# Altium schematic sheet AnalogMux.SchDoc: fNIRS - Analog Mux
size A4; CompanyName: UofT Capstone Team 2024991; DrawnBy: Tony Kim; Engineer: Tony Kim; Revision: 1; SheetNumber: 9; SheetTotal: 13
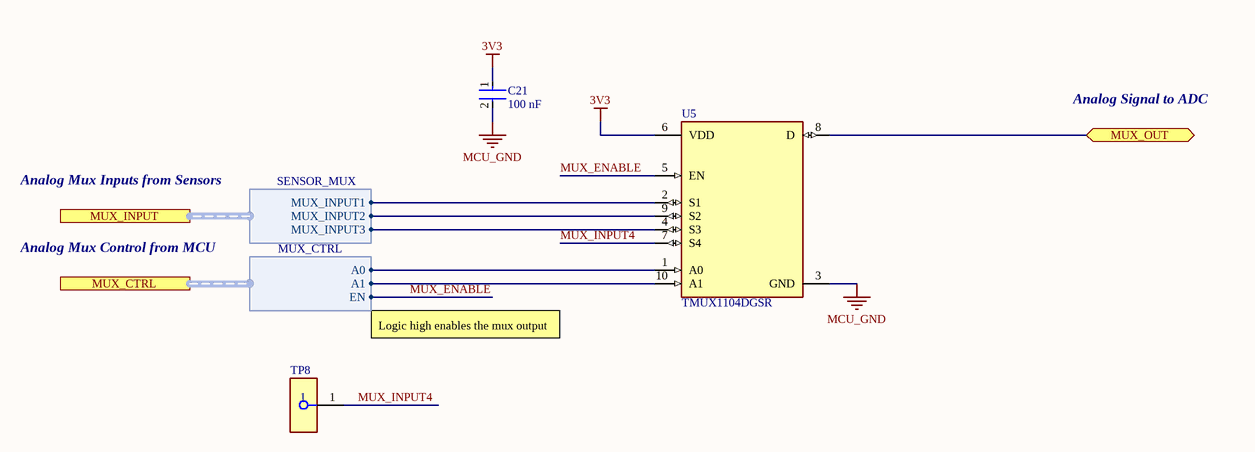
[diagram p0: AnalogMux.SchDoc]

## Parts
C21  Capacitance: 100 nF  [FP-CC0603-DA-MFG]  (hidden comment: CC0603KRX7R7BB104)
TP8  S2761-46R  [FP-S2761-46R-MFG]  (value not drawn)
U5  TMUX1104DGSR  [FP-DGS0010A-MFG]

## Ports
MUX_CTRL (harness MUX_CTRL, see Sensing[3B]), MUX_INPUT (harness SENSOR_MUX, see Sensing[3B]), MUX_OUT (bidir, see Sensing[4B])

## Harnesses
SENSOR_MUX: MUX_INPUT1, MUX_INPUT2, MUX_INPUT3
MUX_CTRL: A0, A1, EN

## Nets
3V3: C21.1 U5.6(VDD)
MCU_GND: C21.2 U5.3(GND)
MUX_ENABLE: U5.5(EN) ; port MUX_CTRL.EN
MUX_INPUT4: TP8.1 U5.7(S4)
MUX_OUT: U5.8(D) ; port MUX_OUT
NetU5_1: U5.1(A0) ; port MUX_CTRL.A0
NetU5_2: U5.2(S1) ; port MUX_INPUT.MUX_INPUT1
NetU5_4: U5.4(S3) ; port MUX_INPUT.MUX_INPUT3
NetU5_9: U5.9(S2) ; port MUX_INPUT.MUX_INPUT2
NetU5_10: U5.10(A1) ; port MUX_CTRL.A1

## Notes on the sheet
- Analog Signal to ADC
- Analog Mux Inputs from Sensors
- Analog Mux Control from MCU
- Logic high enables the mux output

## Library data of the parts
C21 = CMP-2000-05002-2: CAP CER 0.1UF 16V X7R 0603; Manufacturer: YAGEO; Tolerance: 0.1; Value: 100 nF; Temperature Coefficient: 15%; Material: Ceramic; Voltage Rating: 16 V; Package: CC0603-DA; ComponentLink2Description: Datasheet; Octopart: https://octopart.com/cc0603krx7r7bb104-yageo-192941; Temperature Range High: +125°C; Digikey Description: CAP CER 0.1UF 16V X7R 0603; Voltage: 16 V; Device Class L2: Capacitors; Height: 0.9mm; Temperature: -55°C to +125°C; Manufacturer Part Number: CC0603KRX7R7BB104; Device Class L1: Passive Components; Device Class L3: Ceramic Capacitors; ComponentLink2URL: http://www.yageo.com/documents/recent/UPY-GPHC_X7R_6.3V-to-50V_18.pdf; Footprint Url: http://www.yageo.com/exep/pages/download/literatures/UPY-C_GEN_24.pdf; RoHS: TRUE; Temperature Range Low: -55°C; Temperature Characteristic: X7R; Lead Free: Yes; Category: Cap; Mouser Description: Multilayer Ceramic Capacitor, CC Series, 0.1 - F, - 10%, X7R, 16 V, 0603 [1608 Metric]; Automotive: No
TP8 = CMP-15817-000011-1: PC TEST POINT NATURAL; Body Material: Brass; Plating: Tin; Material: Copper Alloy; Mount: Surface Mount; Color: Natural; Packaging: Tape and Reel; RoHS Compliant: Yes
U5 = CMP-04892-000031-2: IC SWITCH SINGLE 10VSSOP; RoHS Compliant: Yes